# EAGLE design 7seg157 (EAGLE 6.6.0)
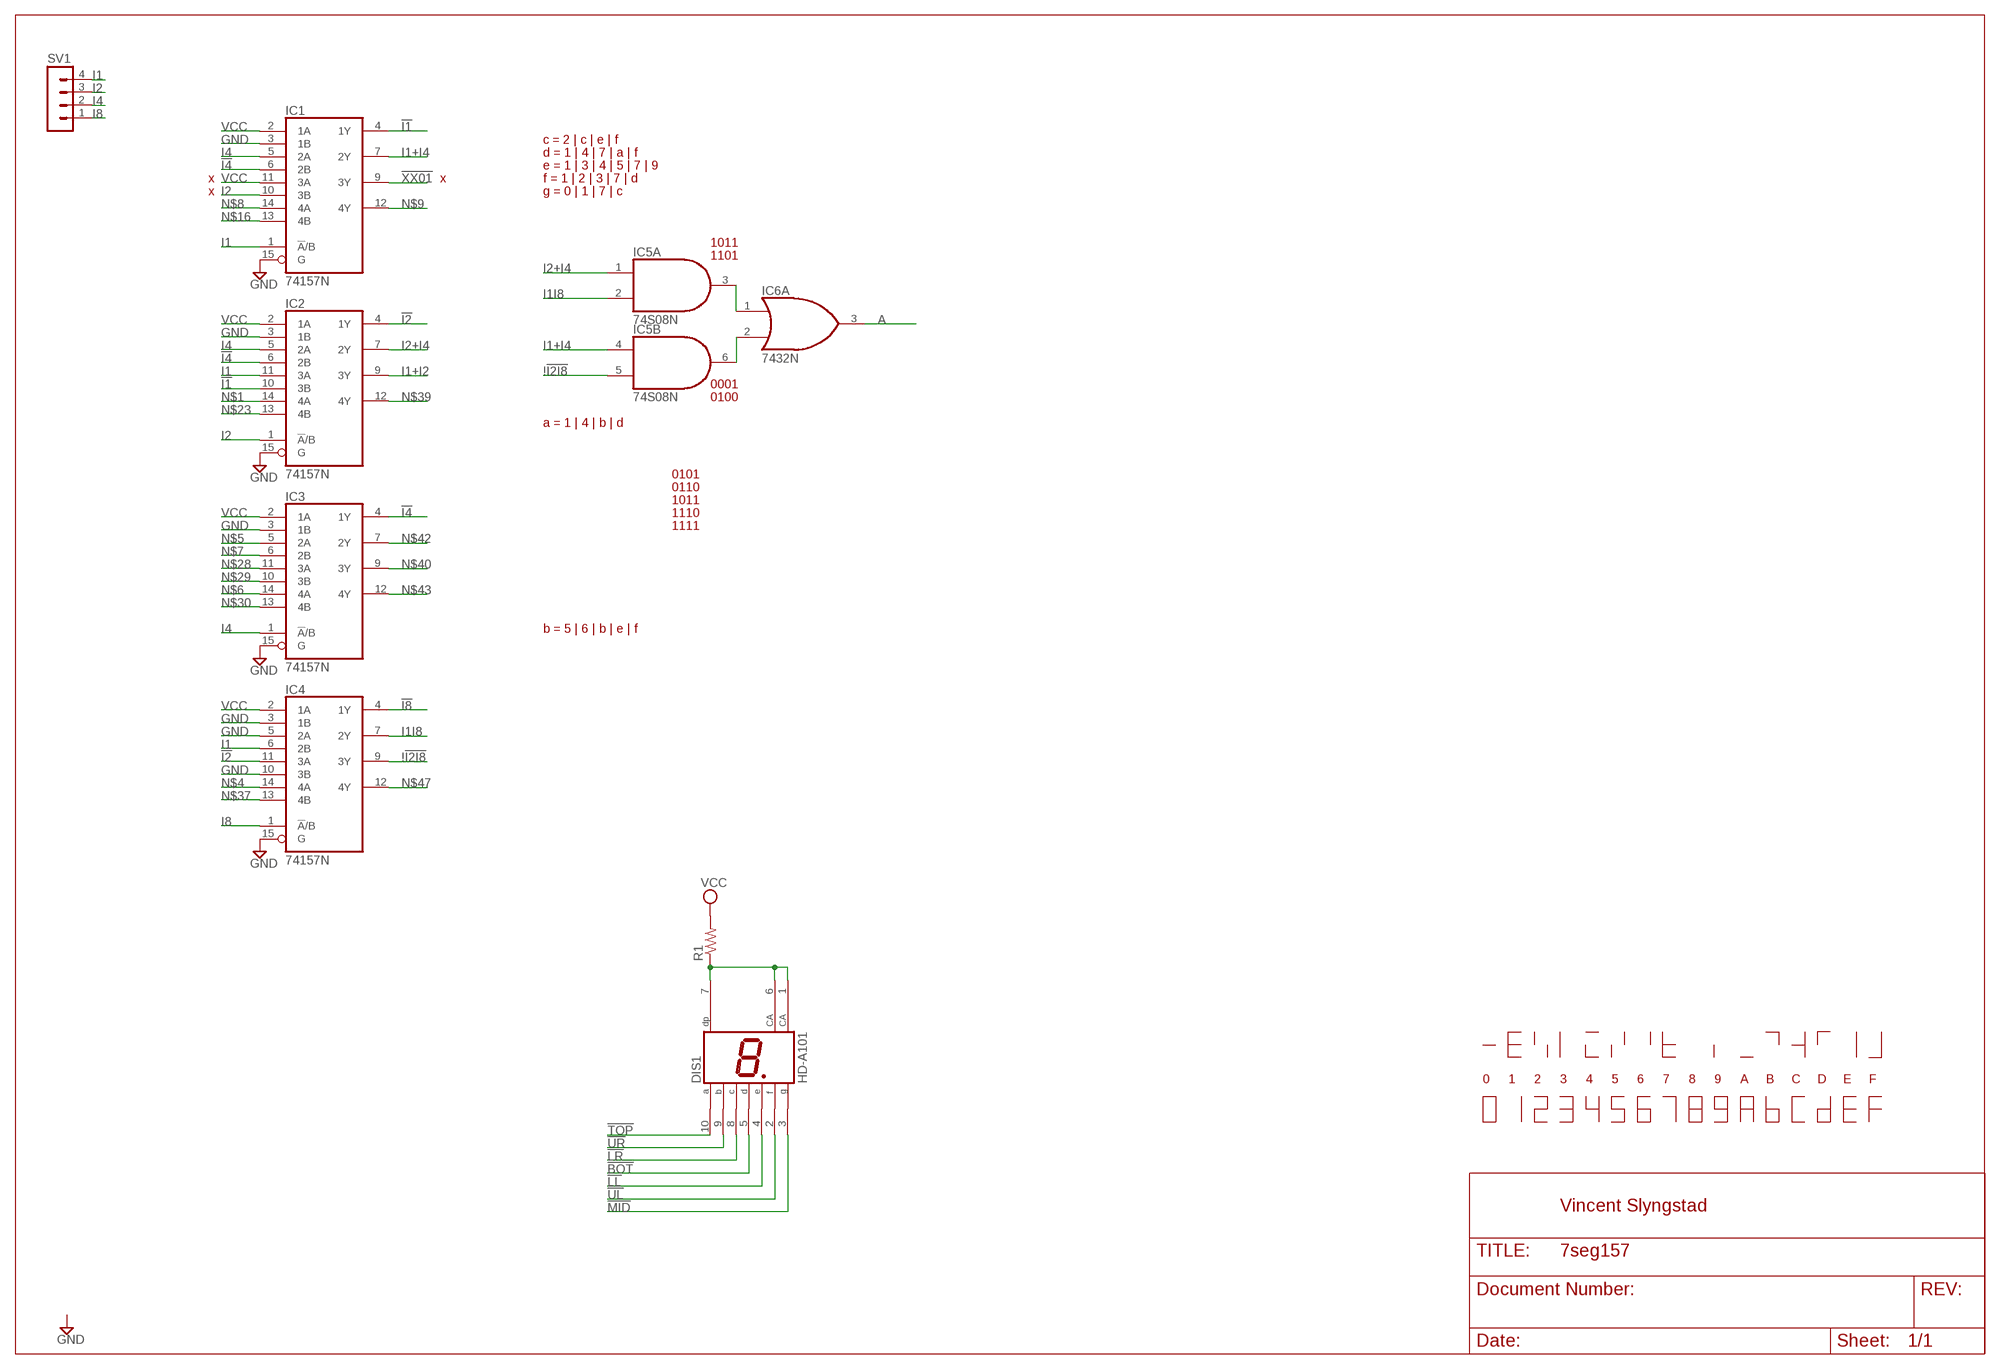
[diagram p0: schematic, sheet 1]

## Parts
DIS1  HD-A101  [HDSP-A]
IC1  74157N  [DIL16]
IC2  74157N  [DIL16]
IC3  74157N  [DIL16]
IC4  74157N  [DIL16]
IC5  74S08N  [DIL14]
IC6  7432N  [DIL14]
R1  R-US_0207/10  [0207/10]
SV1  MA04-1  [MA04-1]

## Nets
!!I2I8: IC4.9(3Y) IC5.5(B:I1)
!BOT: DIS1.5(D)
!I1: IC1.4(1Y) IC2.10(3B)
!I2: IC2.4(1Y) IC4.11(3A)
!I4: IC1.6(2B) IC2.6(2B) IC3.4(1Y)
!I8: IC4.4(1Y)
!LL: DIS1.4(E)
!LR: DIS1.8(C)
!MID: DIS1.3(G)
!TOP: DIS1.10(A)
!UL: DIS1.2(F)
!UR: DIS1.9(B)
!XX01: IC1.9(3Y)
A: IC6.3(A:O)
GND: IC1.3(1B) IC1.15(G) IC2.3(1B) IC2.15(G) IC3.3(1B) IC3.15(G) IC4.3(1B) IC4.5(2A) IC4.10(3B) IC4.15(G)
I1: IC1.1(!A!/B) IC2.11(3A) IC4.6(2B) SV1.4
I1+I2: IC2.9(3Y)
I1+I4: IC1.7(2Y) IC5.4(B:I0)
I1I8: IC4.7(2Y) IC5.2(A:I1)
I2: IC1.10(3B) IC2.1(!A!/B) SV1.3
I2+I4: IC2.7(2Y) IC5.1(A:I0)
I4: IC1.5(2A) IC2.5(2A) IC3.1(!A!/B) SV1.2
I8: IC4.1(!A!/B) SV1.1
N$1: IC2.14(4A)
N$2: DIS1.1(CA) DIS1.6(CA) DIS1.7(DP) R1.1
N$4: IC4.14(4A)
N$5: IC3.5(2A)
N$6: IC3.14(4A)
N$7: IC3.6(2B)
N$8: IC1.14(4A)
N$9: IC1.12(4Y)
N$11: IC5.3(A:O) IC6.1(A:I0)
N$12: IC5.6(B:O) IC6.2(A:I1)
N$16: IC1.13(4B)
N$23: IC2.13(4B)
N$28: IC3.11(3A)
N$29: IC3.10(3B)
N$30: IC3.13(4B)
N$37: IC4.13(4B)
N$39: IC2.12(4Y)
N$40: IC3.9(3Y)
N$42: IC3.7(2Y)
N$43: IC3.12(4Y)
N$47: IC4.12(4Y)
VCC: IC1.2(1A) IC1.11(3A) IC2.2(1A) IC3.2(1A) IC4.2(1A) R1.2
Unconnected: IC5.8(C:O) IC5.9(C:I0) IC5.10(C:I1) IC5.11(D:O) IC5.12(D:I0) IC5.13(D:I1) IC6.4(B:I0) IC6.5(B:I1) IC6.6(B:O) IC6.8(C:O) IC6.9(C:I0) IC6.10(C:I1) IC6.11(D:O) IC6.12(D:I0) IC6.13(D:I1)

## Notes on the sheet
- c = 2 | c | e | f
- d = 1 | 4 | 7 | a | f
- e = 1 | 3 | 4 | 5 | 7 | 9
- x | x | f = 1 | 2 | 3 | 7 | d
- x | g = 0 | 1 | 7 | c
- 1011
- 1101
- 0001
- 0100
- a = 1 | 4 | b | d
- 0101
- 0110
- 1011
- 1110
- 1111
- b = 5 | 6 | b | e | f
- 0 | 1 | 2 | 3 | 4 | 5 | 6 | 7 | 8 | 9 | A | B | C | D | E | F
- Vincent Slyngstad

## Power pins joined to a net without a drawn wire
GND: IC1.8(GND) IC2.8(GND) IC3.8(GND) IC4.8(GND) IC5.7(P:GND) IC6.7(P:GND)
VCC: IC1.16(VCC) IC2.16(VCC) IC3.16(VCC) IC4.16(VCC) IC5.14(P:VCC) IC6.14(P:VCC)

## Library data of the parts
DIS1 = display-hp:HD-A101: LED DISPLAY 1-character 7 segment, decimal point right; OC_FARNELL: unknown; OC_NEWARK: unknown
IC1-IC4 = 74xx-us:74*157: Quadruple 2-line to 1-line data SELECTOR/MULTIPLEXER
IC5 = 74xx-us:74*08: Quad 2-input AND gate
IC6 = 74xx-us:74*32: Quad 2-input OR gate
R1 = rcl:R-US_: RESISTOR, American symbol
SV1 = con-lstb:MA04-1: PIN HEADER; OC_FARNELL: unknown; OC_NEWARK: unknown

## Board
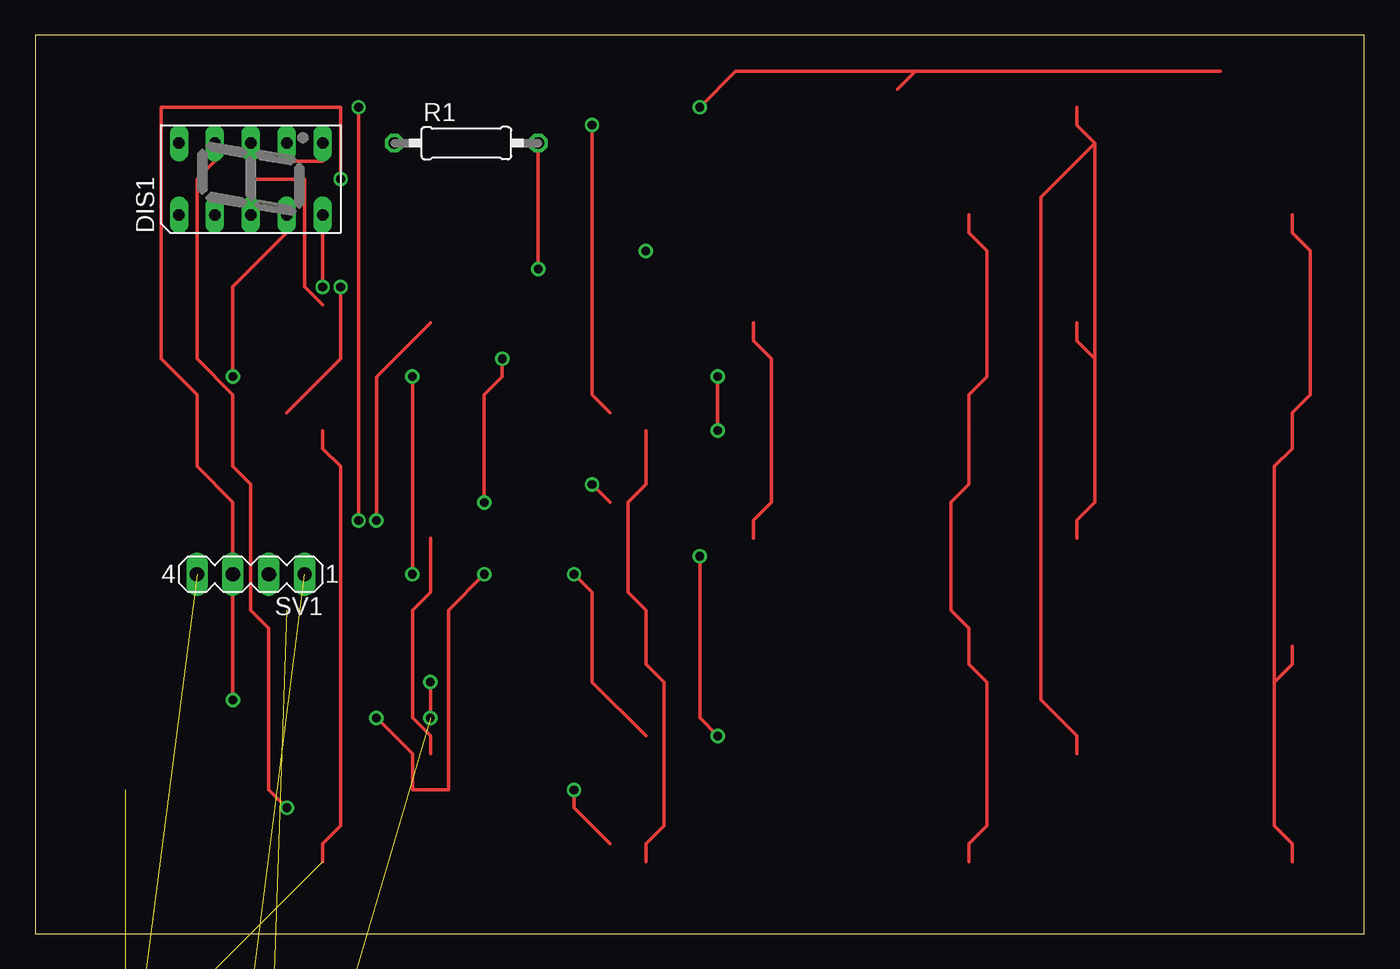
[diagram p1: board, top side]
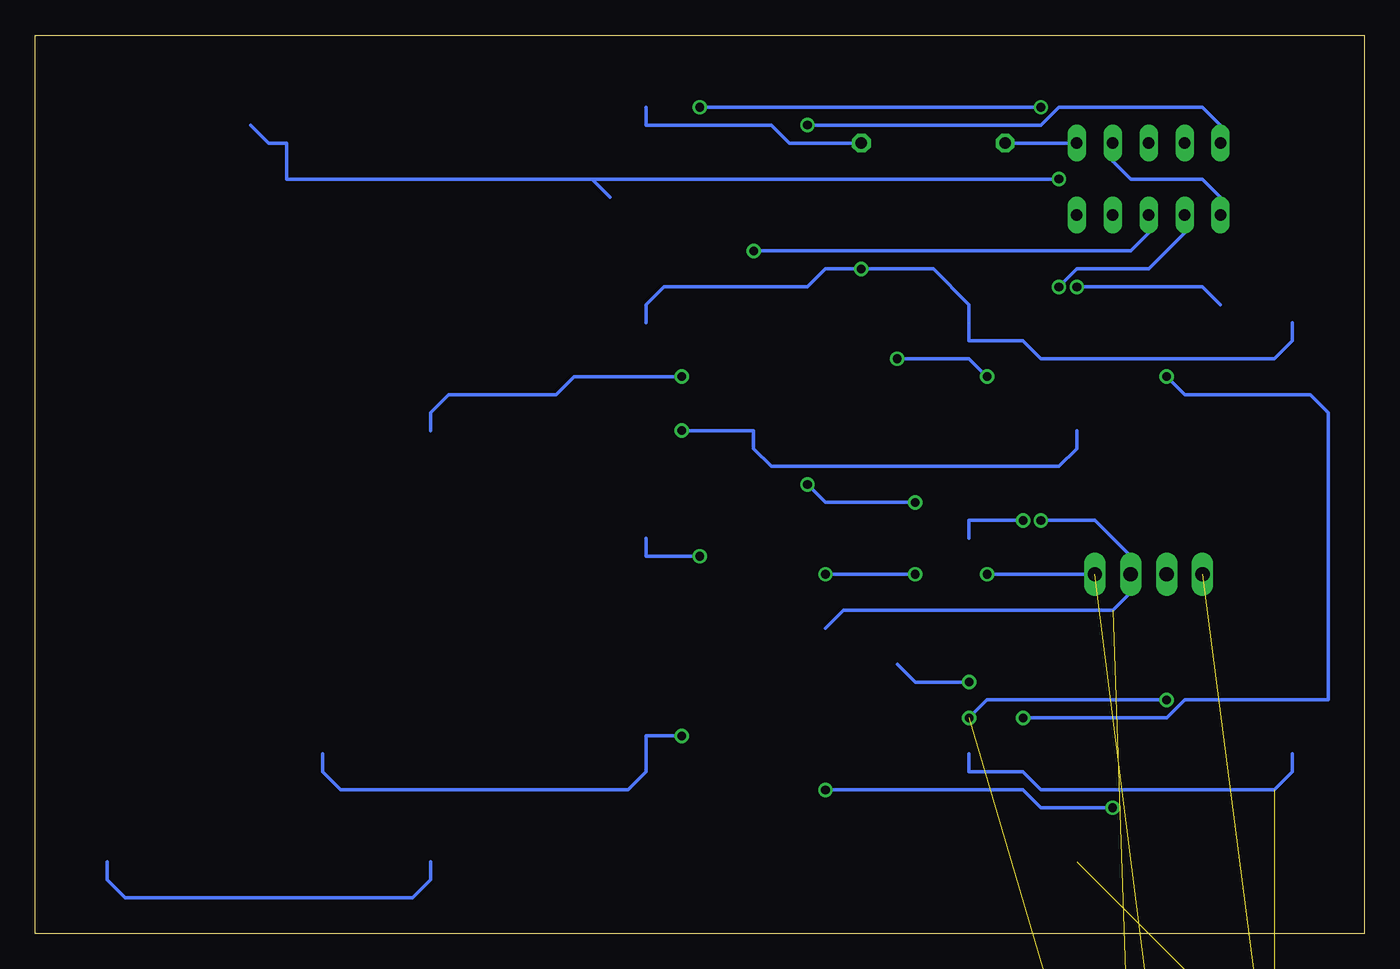
[diagram p2: board, bottom side, seen from below]

Size 93.98 x 63.5 mm. Coordinates in mm from the lower left corner, seen from the top.
Outline: 0,0 93.98,0 93.98,63.5 0,63.5 0,0
Copper layers (1*16): Top 0.035mm / dielectric 1.5mm / Bottom 0.035mm
Design rules "10mils": minimum track width 10mil, minimum drill 24mil, track to track 10mil, track to pad 10mil, pad to pad 10mil, via to via 10mil, smd to smd 10mil, copper to edge 25mil, drill to drill 10mil, minimum pad ring 10mil, minimum via ring 8mil, stop-mask expansion 0mil, vias tented up to drill 0mil, thermal gap 10mil

### Footprints (pad centres in the part's own frame; a part is rotated, then mirrored left to right if it is on the bottom)
HDSP-A = drill 0.813 long: 1 -2.54,5.08; 2 -2.54,2.54; 3 -2.54,0; 4 -2.54,-2.54; 5 -2.54,-5.08; 6 2.54,-5.08; 7 2.54,-2.54; 8 2.54,0; 9 2.54,2.54; 10 2.54,5.08
DIL16 = drill 0.813 long: 1 -8.89,-3.81; 2 -6.35,-3.81; 3 -3.81,-3.81; 4 -1.27,-3.81; 5 1.27,-3.81; 6 3.81,-3.81; 7 6.35,-3.81; 8 8.89,-3.81; 9 8.89,3.81; 10 6.35,3.81; 11 3.81,3.81; 12 1.27,3.81; 13 -1.27,3.81; 14 -3.81,3.81; 15 -6.35,3.81; 16 -8.89,3.81
DIL14 = drill 0.813 long: 1 -7.62,-3.81; 2 -5.08,-3.81; 3 -2.54,-3.81; 4 0,-3.81; 5 2.54,-3.81; 6 5.08,-3.81; 7 7.62,-3.81; 8 7.62,3.81; 9 5.08,3.81; 10 2.54,3.81; 11 0,3.81; 12 -2.54,3.81; 13 -5.08,3.81; 14 -7.62,3.81
0207/10 = drill 0.813 octagon: 1 -5.08,0; 2 5.08,0
MA04-1 = drill 1.016 long: 1 -3.81,0; 2 -1.27,0; 3 1.27,0; 4 3.81,0

### Placement (x,y rotation side)
DIS1  15.24,53.34 90 top
IC1  15.24,-10.16 0 top  (outside the outline)
IC2  15.24,-30.48 0 top  (outside the outline)
IC3  15.24,-50.8 0 top  (outside the outline)
IC4  15.24,-71.12 0 top  (outside the outline)
IC5  13.97,-91.44 0 top  (outside the outline)
IC6  13.97,-111.76 0 top  (outside the outline)
R1  30.48,55.88 0 top
SV1  15.24,25.4 180 top

### Tracks (layer width: path | path; a pad name or v marks a point on that pad's centre or on a via)
!!I2I8  (1 unrouted)
!BOT  (via drill 0.61)
  Top 0.254: v20.32,45.72 DIS1.5
  Bottom 0.254: 10.16,44.45 11.43,45.72 v20.32,45.72
!I1  (1 unrouted)
!I2  (1 unrouted)
!I4  (2 unrouted)
!LL  (via drill 0.61)
  Top 0.254: v13.97,39.37 13.97,45.72 17.78,49.53 DIS1.4 | v24.13,15.24 26.67,12.7 26.67,10.16 29.21,10.16 29.21,22.86 v31.75,25.4 | v38.1,25.4 39.37,24.13 39.37,17.78 43.18,13.97
  Bottom 0.254: v13.97,39.37 12.7,38.1 3.81,38.1 2.54,36.83 2.54,16.51 12.7,16.51 13.97,15.24 v24.13,15.24 | v31.75,25.4 v38.1,25.4
!LR
  Top 0.254: 20.32,44.45 19.05,45.72 19.05,53.34 15.24,53.34 DIS1.8
!MID  (via drill 0.61)
  Bottom 0.254: v43.18,48.26 16.51,48.26 15.24,49.53 DIS1.3
!TOP  (via drill 0.61)
  Top 0.254: 40.64,36.83 39.37,38.1 v39.37,57.15
  Bottom 0.254: v39.37,57.15 22.86,57.15 21.59,58.42 11.43,58.42 10.16,57.15 DIS1.10
!UL  (via drill 0.61)
  Top 0.254: 17.78,36.83 21.59,40.64 v21.59,45.72
  Bottom 0.254: v21.59,45.72 20.32,46.99 15.24,46.99 12.7,49.53 DIS1.2
!UR  (via drill 0.61)
  Top 0.254: 40.64,6.35 38.1,8.89 v38.1,10.16 | v17.78,8.89 16.51,10.16 16.51,21.59 15.24,22.86 15.24,31.75 13.97,33.02 13.97,38.1 11.43,40.64 11.43,53.34 12.7,54.61 DIS1.9
  Bottom 0.254: v38.1,10.16 24.13,10.16 22.86,8.89 v17.78,8.89
GND  (via drill 0.61)  (21 unrouted)
  Top 0.254: 43.18,5.08 43.18,6.35 44.45,7.62 44.45,17.78 43.18,19.05 43.18,20.32 43.18,22.86 41.91,24.13 41.91,30.48 43.18,31.75 43.18,35.56 | 20.32,5.08 20.32,6.35 21.59,7.62 21.59,33.02 20.32,34.29 20.32,35.56 | 66.04,5.08 66.04,6.35 67.31,7.62 67.31,17.78 66.04,19.05 66.04,20.32 66.04,21.59 64.77,22.86 64.77,30.48 66.04,31.75 66.04,35.56 66.04,38.1 67.31,39.37 67.31,48.26 66.04,49.53 66.04,50.8 | 87.63,17.78 87.63,7.62 88.9,6.35 88.9,5.08 | 87.63,17.78 88.9,19.05 88.9,20.32 | 87.63,17.78 87.63,33.02 88.9,34.29 88.9,35.56 88.9,36.83 90.17,38.1 90.17,48.26 88.9,49.53 88.9,50.8 | v48.26,35.56 v48.26,39.37
  Bottom 0.254: 20.32,35.56 20.32,34.29 21.59,33.02 41.91,33.02 43.18,34.29 43.18,35.56 v48.26,35.56 | 66.04,5.08 66.04,3.81 67.31,2.54 87.63,2.54 88.9,3.81 88.9,5.08 | v48.26,39.37 55.88,39.37 57.15,38.1 64.77,38.1 66.04,36.83 66.04,35.56
I1  (3 unrouted)
I1+I4  (1 unrouted)
I1I8  (1 unrouted)
I2  (via drill 0.61)  (2 unrouted)
  Top 0.254: v27.94,15.24 v27.94,17.78 | v13.97,16.51 SV1.3 13.97,30.48 11.43,33.02 11.43,38.1 8.89,40.64 8.89,58.42 21.59,58.42 v21.59,53.34
  Bottom 0.254: 33.02,19.05 31.75,17.78 v27.94,17.78 | v27.94,15.24 26.67,16.51 v13.97,16.51 | 78.74,57.15 77.47,55.88 76.2,55.88 76.2,53.34 54.61,53.34 | 54.61,53.34 53.34,52.07 | v21.59,53.34 54.61,53.34
I2+I4  (1 unrouted)
I4  (via drill 0.61)  (3 unrouted)
  Top 0.254: 62.23,60.96 60.96,59.69 | 62.23,60.96 83.82,60.96 | v22.86,29.21 v22.86,58.42 | v46.99,58.42 49.53,60.96 62.23,60.96
  Bottom 0.254: 38.1,21.59 36.83,22.86 17.78,22.86 16.51,24.13 SV1.2 16.51,26.67 19.05,29.21 v22.86,29.21 | v22.86,58.42 v46.99,58.42
I8  (via drill 0.61)  (1 unrouted)
  Top 0.254: v26.67,25.4 v26.67,39.37 | v33.02,40.64 33.02,39.37 31.75,38.1 v31.75,30.48 | v39.37,31.75 40.64,30.48
  Bottom 0.254: SV1.1 v26.67,25.4 | v26.67,39.37 27.94,40.64 v33.02,40.64 | v31.75,30.48 38.1,30.48 v39.37,31.75
N$2
  Top 0.254: DIS1.6 20.32,54.61 17.78,54.61 DIS1.7
  Bottom 0.254: DIS1.1 10.16,52.07 11.43,53.34 16.51,53.34 17.78,54.61 DIS1.7 | DIS1.6 R1.1
N$11  (1 unrouted)
N$12  (1 unrouted)
VCC  (via drill 0.61)  (17 unrouted)
  Top 0.254: 74.93,40.64 74.93,30.48 73.66,29.21 73.66,27.94 | 74.93,40.64 73.66,41.91 73.66,43.18 | 74.93,55.88 73.66,57.15 73.66,58.42 | 74.93,55.88 74.93,40.64 | 74.93,55.88 71.12,52.07 71.12,16.51 73.66,13.97 73.66,12.7 | 27.94,27.94 27.94,24.13 26.67,22.86 26.67,15.24 27.94,13.97 27.94,12.7 | 50.8,27.94 50.8,29.21 52.07,30.48 52.07,40.64 50.8,41.91 50.8,43.18 | v35.56,46.99 R1.2 | v24.13,29.21 24.13,39.37 27.94,43.18 | v48.26,13.97 46.99,15.24 v46.99,26.67
  Bottom 0.254: 73.66,12.7 73.66,11.43 72.39,10.16 52.07,10.16 50.8,11.43 50.8,12.7 50.8,13.97 v48.26,13.97 | 5.08,12.7 5.08,11.43 6.35,10.16 22.86,10.16 24.13,11.43 27.94,11.43 27.94,12.7 | R1.2 40.64,55.88 41.91,57.15 50.8,57.15 50.8,58.42 | 5.08,43.18 5.08,41.91 6.35,40.64 22.86,40.64 24.13,41.91 27.94,41.91 27.94,43.18 27.94,44.45 30.48,46.99 v35.56,46.99 38.1,46.99 39.37,45.72 49.53,45.72 50.8,44.45 50.8,43.18 | v24.13,29.21 27.94,29.21 27.94,27.94 | v46.99,26.67 50.8,26.67 50.8,27.94